# Altium schematic sheet Barometer.SchDoc
size A4; SheetNumber: 6; SheetTotal: 8
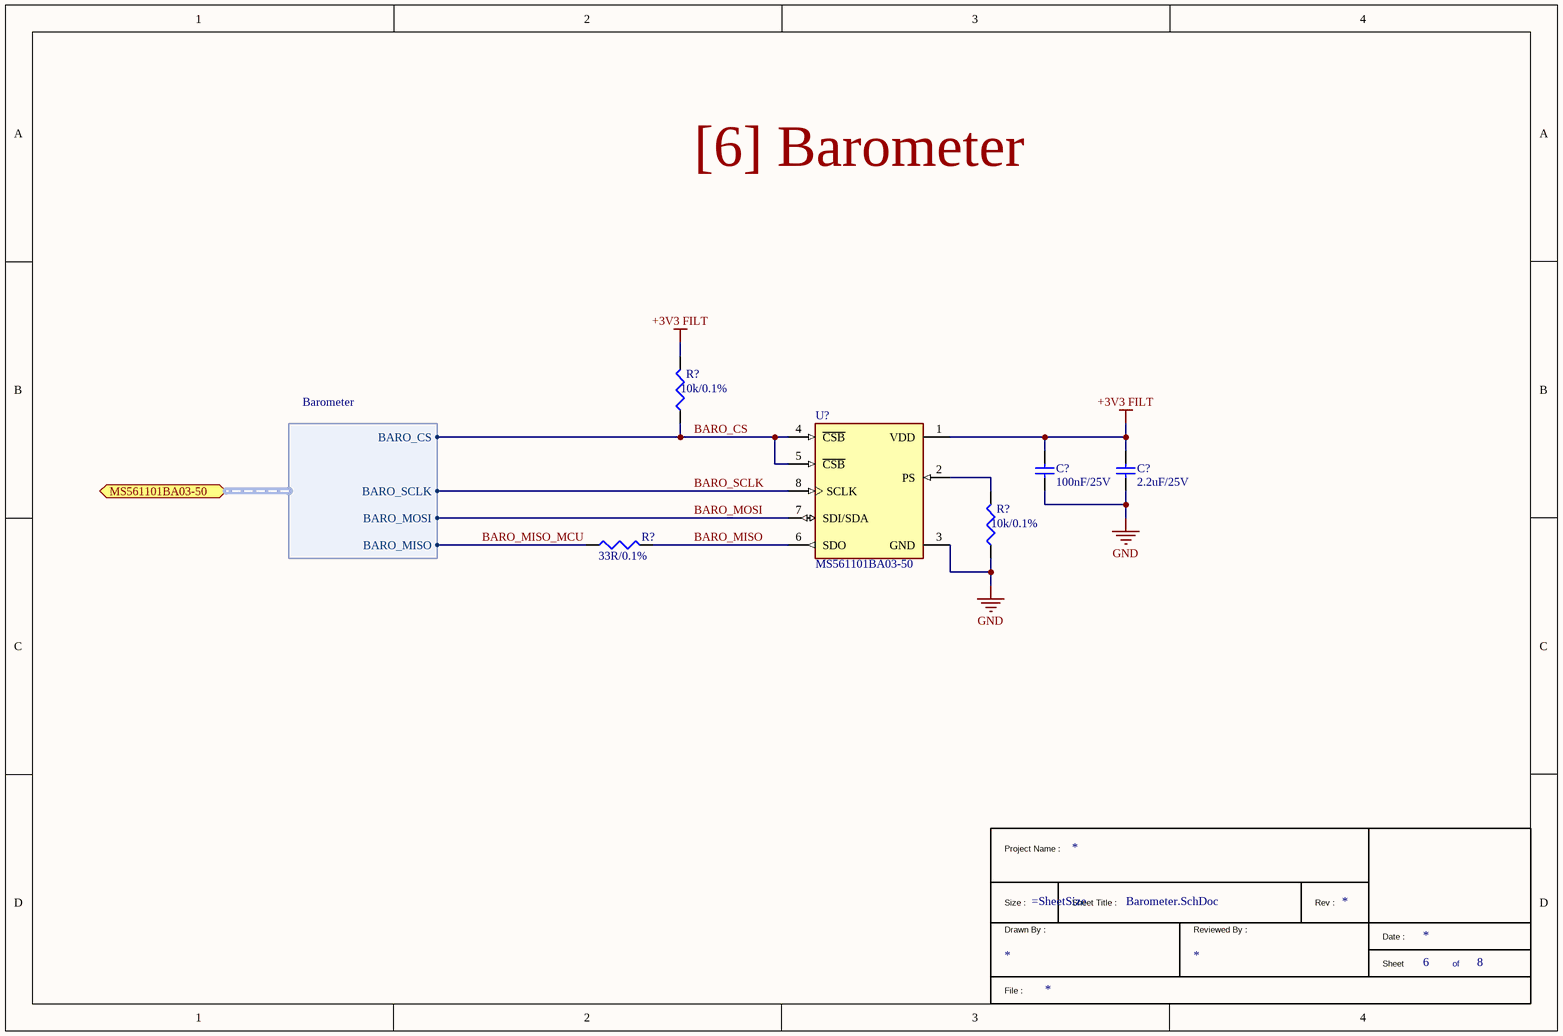
[diagram p0: Barometer.SchDoc]

## Parts
(Parts that share a designator on the sheet are numbered #1, #2 ... from top to bottom, then left to right.)
*  TitleBlock1  (value not drawn)  (graphical)
C?#1  100nF/25V  [CAP_0402]
C?#2  2.2uF/25V  [CAP_0805]
R?#1  10k/0.1%  [RES_0402]
R?#2  10k/0.1%  [RES_0402]
R?#3  33R/0.1%  [RES_0402]
U?  MS561101BA03-50  [MS561101BA03-50_QFN-8(3x5)]

## Ports
MS561101BA03-50 (bidir, harness Barometer)

## Harnesses
Barometer: BARO_CS, BARO_SCLK, BARO_MOSI, BARO_MISO

## Nets
+3V3 FILT: C?#1.2 C?#2.2 R?#1.2 U?.1(VDD)
GND: C?#1.1 C?#2.1 R?#2.1 U?.3(GND)
BARO_CS: R?#1.1 U?.4(~{CSB}) U?.5(~{CSB}) ; port MS561101BA03-50.BARO_CS
BARO_MISO: R?#3.2 U?.6(SDO)
BARO_MISO_MCU: R?#3.1 ; port MS561101BA03-50.BARO_MISO
BARO_MOSI: U?.7(SDI/SDA) ; port MS561101BA03-50.BARO_MOSI
BARO_SCLK: U?.8(SCLK) ; port MS561101BA03-50.BARO_SCLK
NetR?#2_2: R?#2.2 U?.2(PS)

## Notes on the sheet
- [6] Barometer
- (in symbol TitleBlock1) Project Name :; Size :; Sheet Title :; Rev :; Drawn By :; Reviewed By :; Date :; Sheet; of; File :

## Library data of the parts
C?#1 = YAGEO CC0402JRX7R8BB104: 100nF ±5% 25V Ceramic Capacitor X7R 0402; Manufacturer: YAGEO; Manufacturer Part Number: CC0402JRX7R8BB104; LCSC Part Number: C541465; Package: 0402; Mounting Type: SMD; ComponentLink2Description: Digikey Link; ComponentLink3Description: LCSC Link; ComponentLink3URL: https://www.lcsc.com/product-detail/C541465.html?spm=wm.fly.bg.0.xh___wm.fly.dhl.mly.12-0-4&lcsc_vid=QlAIX1RQQQJfX1VRTwcNAQJXTlRaUQBVEQBYAwJfFFcxVlNRQFhYU1xWRFVdXztW
C?#2 = YAGEO CC0805KKX7R8BB225: 2.2uF ±10% 25V Ceramic Capacitor X7R 0805; Manufacturer: YAGEO; Manufacturer Part Number: CC0805KKX7R8BB225; LCSC Part Number: C277470; Package: 0805; Mounting Type: SMD; ComponentLink2Description: Digikey Link; ComponentLink3Description: LCSC Link; ComponentLink3URL: https://www.lcsc.com/product-detail/C277470.html?spm=wm.fly.bg.0.xh___wm.sy.dhl.mly.12-0-4&lcsc_vid=QlAIX1RQQQJfX1VRTwcNAQJXTlRaUQBVEQBYAwJfFFcxVlNRT1BcUFBQTlRYVTtW
R?#1 R?#2 = YAGEO RT0402BRD0710KL: 62.5mW 10kΩ 50V Thin Film Resistor ±25ppm/℃ ±0.1% 0402 Chip Resistor - Surface Mount RoHS; Manufacturer: YAGEO; Manufacturer Part Number: RT0402BRD0710KL; LCSC Part Number: C190095; Package: 0402; ComponentLink1Description: Digikey Link; Mounting Type: SMD; ComponentLink2Description: LCSC Link; ComponentLink2URL: https://www.lcsc.com/product-detail/C190095.html?spm=wm.fly.bg.0.xh___wm.fly.dhl.mly.12-6-1&lcsc_vid=QlAIX1RQQQJfX1VRTwcNAQJXTlRaUQBVEQBYAwJfFFcxVlNRT1FbV1FfR1JZUDsOAxUeFF5JWBYZEEoKFBINSQcJGk4dAgUUFAk%3D
R?#3 = YAGEO RT0402BRD0733RL: 33Ω 63mW 50V Thin Film Resistor ±25ppm/℃ ±0.1% 0402 Chip Resistor - Surface Mount RoHS; Manufacturer: YAGEO; Manufacturer Part Number: RT0402BRD0733RL; LCSC Part Number: C852729; Package: 0402; ComponentLink1Description: Digikey Link; Mounting Type: SMD; ComponentLink2Description: LCSC Link; ComponentLink2URL: https://www.lcsc.com/product-detail/C852729.html?spm=wm.fly.bg.0.xh___wm.fly.dhl.mly.12-6-1&lcsc_vid=QlAIX1RQQQJfX1VRTwcNAQJXTlRaUQBVEQBYAwJfFFcxVlNRT1BXUFVTRlNXVDtW
U? = TE Connectivity MS561101BA03-50: 1Kpa~1.2bar QFN-8(3x5) Pressure Sensors, Transducers RoHS; Manufacturer: TE Connectivity; Manufacturer Part Number: MS561101BA03-50; LCSC Part Number: C15639; Package: QFN-8(3x5); Mounting Type: SMD; ComponentLink2Description: Digikey Link; ComponentLink3Description: LCSC Link; ComponentLink3URL: https://www.lcsc.com/product-detail/C15639.html?s_z=n_q_C15639